# Altium project RPI Adapter Board.PrjPcb
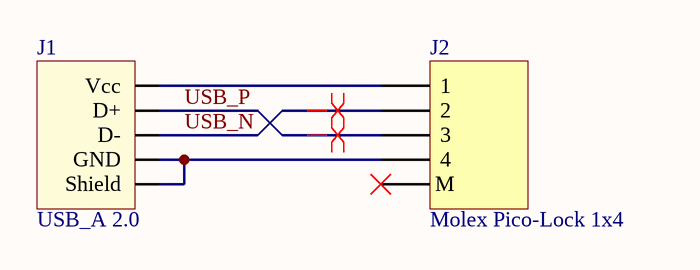
[diagram p0: RPI Adapter Board.SchDoc]
1 sheet, 2 parts. Net scope: global (net labels, ports and power ports of the same name join across sheets).
Board file: RPI Adapter Board.PcbDoc

## Sheet RPI Adapter Board.SchDoc
size A3

### Parts
J1  USB_A 2.0  [USB_A_M_TH_V]
J2  Molex Pico-Lock 1x4  [5037630491]

### Nets
USB_N: J1.2(D-) J2.2
USB_P: J1.3(D+) J2.3
NetJ1_1: J1.1(Vcc) J2.1
NetJ1_4: J1.4(GND) J1.5(Shield) J2.4

Not connected (* = marked no-connect by the designer): J2 5(M)*

### Layout directives
differential pair: USB_N, USB_P

### Library data of the parts
J1 = Kandens USB_A 2.0: Manufacturer Part Number: AM 15.0; ComponentLinkDescription: Datasheet; FR_SN: J-23; Part Number: Kandens USB_A 2.0; Value: USB_A 2.0; ComponentLinkURL: https://sc02.alicdn.com/kf/Hb5bc4045d1a641a4a6ab2afd0a44bb88U/246867406/Hb5bc4045d1a641a4a6ab2afd0a44bb88U.png_.webp; Supplier Part Number: Alibaba
J2 = Molex Pico-Lock 1x4: Manufacturer Part Number: 503763-0491; ComponentLinkDescription: Datasheet; FR_SN: J-21; Part Number: Molex Pico-Lock 1x4; Value: Molex Pico-Lock 1x4; ComponentLinkURL: https://hr.mouser.com/datasheet/2/276/2/5037630491_PCB_HEADERS-463683.pdf; Supplier Part Number: 538-503763-0491